# Altium project PCB_Project_sch_layout.PrjPcb
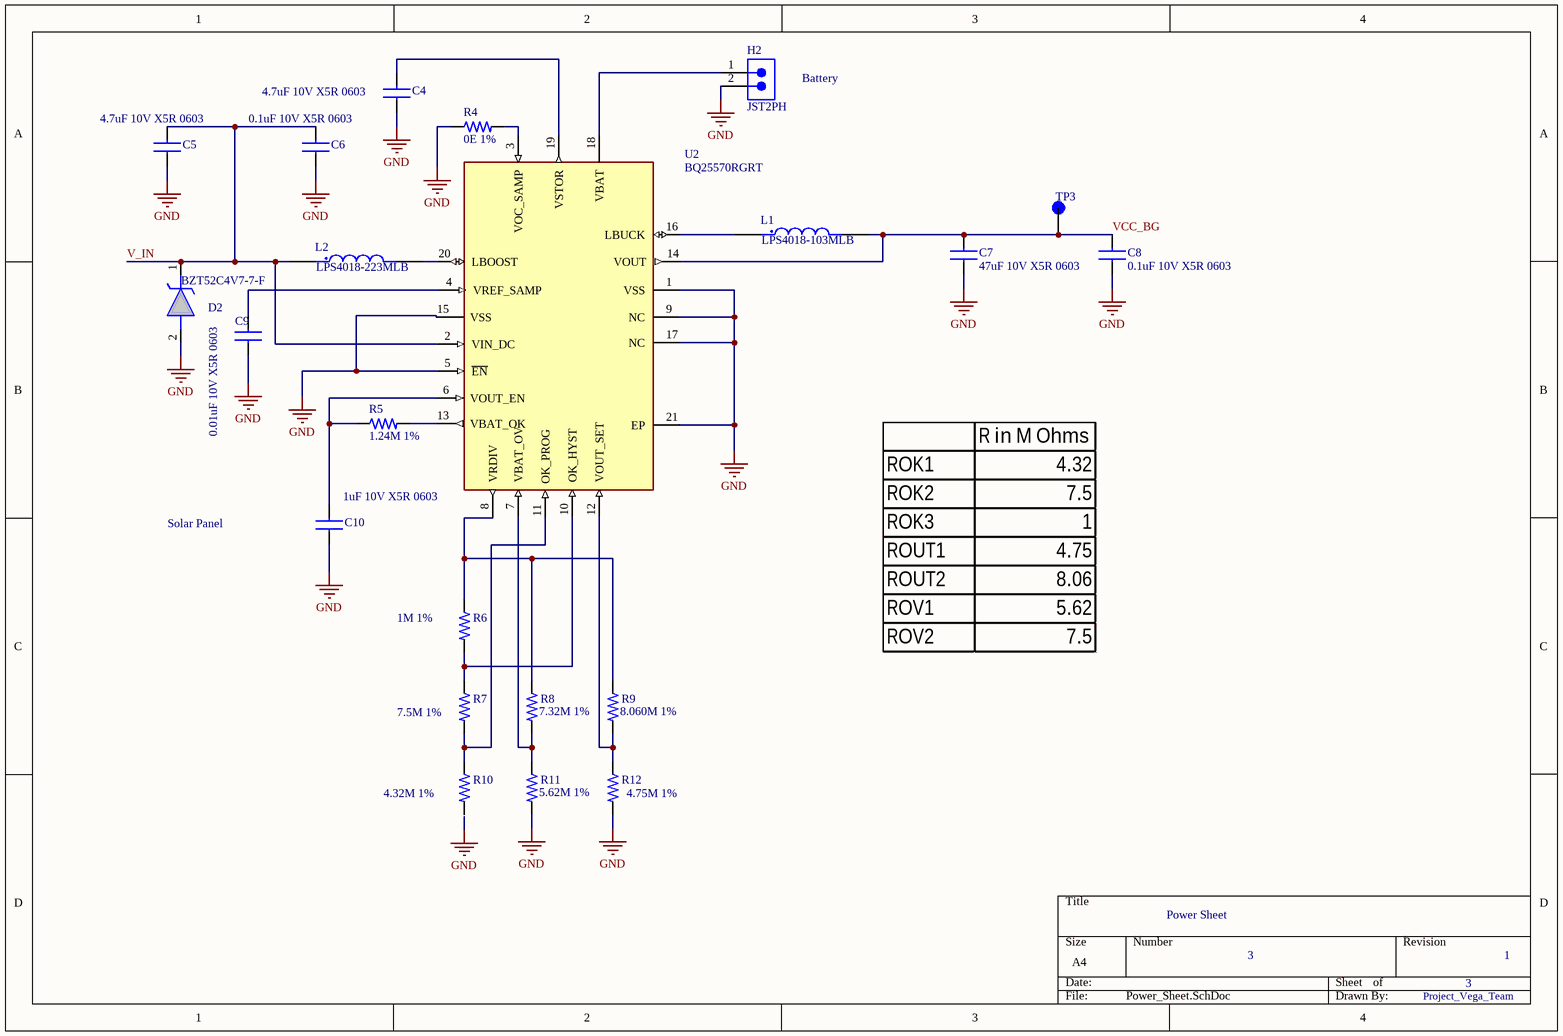
[diagram p0: Power_Sheet.SchDoc]
5 sheets, 120 parts. Net scope: flat (ports and power ports of the same name join across sheets).
Sheets:
  Power_Sheet.SchDoc
  Principal_Node.SchDoc
  Project_Node_Sensors.SchDoc
  Client_Node_1.SchDoc
  Client_Node_2.SchDoc

## Sheet Power_Sheet.SchDoc: Power Sheet
size A4; DrawnBy: Project_Vega_Team; Revision: 1; SheetNumber: 3; SheetTotal: 7

### Parts
C4  4.7uF 10V X5R 0603  [CAP_0603_1MM]
C5  4.7uF 10V X5R 0603  [CAP_0603_1MM]
C6  0.1uF 10V X5R 0603  [CAP_0603_1MM]
C7  47uF 10V X5R 0603  [CAP_0603_1MM]
C8  0.1uF 10V X5R 0603  [CAP_0603_1MM]
C9  0.01uF 10V X5R 0603  [CAP_0603_1MM]
C10  1uF 10V X5R 0603  [CAP_0603_1MM]
D2  BZT52C4V7-7-F  [SOD3716X145N]
H2  JST2PH  [JST_B2B-PH-K-S(LF)(SN)]
L1  LPS4018-103MLB  [IND_LPS4018-223MRC]
L2  LPS4018-223MLB  [IND_LPS4018-223MRC]
R4  0E 1%  [RES_0603_1608X06]
R5  1.24M 1%  [RES_0603_1608X06]
R6  1M 1%  [RES_0603_1608X06]
R7  7.5M 1%  [RES_0603_1608X06]
R8  7.32M 1%  [RES_0603_1608X06]
R9  8.060M 1%  [RES_0603_1608X06]
R10  4.32M 1%  [RES_0603_1608X06]
R11  5.62M 1%  [RES_0603_1608X06]
R12  4.75M 1%  [RES_0603_1608X06]
TP3  Test_point  [TP]  (value not drawn)
U2  BQ25570RGRT  [QFN50P350X350X100-21N]

### Nets
GND: C4.1 C5.1 C6.1 C7.1 C8.1 C9.1 C10.1 D2.2(A) H2.2 R4.1 R11.2 R12.2 U2.1(VSS) U2.5(~{EN}) U2.9(NC) U2.15(VSS) U2.17(NC) U2.21(EP)
V_IN: C5.2 C6.2 D2.1(K) L2.1 U2.2(VIN_DC)
VCC_BG: C7.2 C8.2 L1.2 TP3.TP U2.14(VOUT)
NetC4_2: C4.2 U2.19(VSTOR)
NetC9_2: C9.2 U2.4(VREF_SAMP)
NetC10_2: C10.2 R5.1 U2.6(VOUT_EN)
NetH2_1: H2.1 U2.18(VBAT)
NetL1_1: L1.1 U2.16(LBUCK)
NetL2_2: L2.2 U2.20(LBOOST)
NetR4_2: R4.2 U2.3(VOC_SAMP)
NetR5_2: R5.2 U2.13(VBAT_OK)
NetR6_1: R6.1 R8.1 R9.1 U2.8(VRDIV)
NetR6_2: R6.2 R7.1 U2.10(OK_HYST)
NetR7_2: R7.2 R10.1 U2.11(OK_PROG)
NetR8_2: R8.2 R11.1 U2.7(VBAT_OV)
NetR9_2: R9.2 R12.1 U2.12(VOUT_SET)

Not connected (* = marked no-connect by the designer): R10 2

### Notes on the sheet
- Battery
- Solar Panel

### Library data of the parts
C4-C10 = GRM188R61A226ME15D: CAP CER 22UF 10V X5R 0603; Manufacturer: Murata; Voltage Rating DC: 10 VDC; Tolerance: 20 %; Brand: Murata Electronics; Type: Voltage and Temperature Derating Recommended Product; Unit Weight: 0.000222 oz; Supplier 1: Digi-Key; Supplier Part Number 1: 490-10476-1-ND; Manufacturer Part Number: GRM188R61A226ME15D; Stock 1: 849458; Pricing 1: 1=0.33, 10=0.226, 50=0.1506, 100=0.1279, 500=0.0903, 1000=0.079 (USD); Product Category: Multilayer Ceramic Capacitors MLCC - SMD/SMT; RoHS: True; Capacitance: 22 uF; Dielectric: X5R; Case Code - in: 0603; Case Code - mm: 1608; Height: 0.8 mm; Maximum Operating Temperature: + 85 C; Minimum Operating Temperature: - 55 C; Product: General Type MLCCs; Series: GRM; Packaging: Reel; Length: 1.6 mm; Package / Case: 0603 (1608 metric); Factory Pack Quantity: 4000; Termination Style: SMD/SMT; Width: 0.8 mm; ComponentLink1URL: http://www.farnell.com/datasheets/2047978.pdf?src-supplier=Element14; ComponentLink1Description: http://www.farnell.com/datasheets/2047978.pdf?src-supplier=Element14
D2 = BZT52C4V7-7-F: Diodes Inc BZT52C4V7-7-F Zener Diode, 4.7V 7% 500 mW SMT 2-Pin SOD-123; Manufacturer_Name: Diodes Incorporated; Geometry.Height: 1.45mm; Manufacturer_Part_Number: BZT52C4V7-7-F; Mouser Part Number: 621-BZT52C4V7-F; Mouser Price/Stock: https://www.mouser.co.uk/ProductDetail/Diodes-Incorporated/BZT52C4V7-7-F?qs=J8U5V1LGimN8O12FVAOKUQ%3D%3D; Arrow Part Number: BZT52C4V7-7-F; Arrow Price/Stock: https://www.arrow.com/en/products/bzt52c4v7-7-f/diodes-incorporated?region=nac; Datasheet Link: https://www.diodes.com/assets/Datasheets/ds18004.pdf
H2 = JST2PH: Connector Header Through Hole 2 position 0.079" (2.00mm); Manufacturer: JST; Manufacturer Part Number: B2B-PH-K-S; Supplier: Digi-Key; Supplier Part Number: 455-1704-ND; RoHS: Yes; Category: Connectors; Stock: 1077617; Pricing: 1=0.19, 10=0.147, 100=0.1088, 500=0.09006, 1000=0.0788, 5000=0.06754, 10000=0.06567 (USD); ComponentLink1URL: https://datasheet.ciiva.com/6905/phseries-6905929.pdf?src-supplier=Digi-Key; ComponentLink1Description: https://datasheet.ciiva.com/6905/phseries-6905929.pdf?src-supplier=Digi-Key
L1 L2 = LPS4018-223MRC: 22 µH Shielded Drum Core Inductor 650 mA 360mOhm Max Nonstandard; MF: Coilcraft; SnapEDA_Link: https://www.snapeda.com/parts/LPS4018-223MRC/Coilcraft/view-part/?ref=snap; Package: None; Value: *; MP: LPS4018-223MRC; Check_prices: https://www.snapeda.com/parts/LPS4018-223MRC/Coilcraft/view-part/?ref=eda
R4-R12 = RC0603FR-07316KL: SMD Chip Resistor, 316 kOhm, ± 1%, 100 mW, 0603 [1608 Metric], Thick Film, General Purpose; Manufacturer: Yageo; Value: 316kR; Power Rating: 100mW; Voltage Rating: 50V; Temperature Coefficient: 100ppm/°C; Supplier: Digikey; Supplier Part Number: 311-316KHRCT-ND; Manufacturer Part Number: RC0603FR-07316KL; RoHS: Yes; Category: Chip SMD Resistors; Stock: 149463; Pricing: 1=0.1, 10=0.019, 50=0.0112, 100=0.0093, 500=0.00622, 1000=0.00532 (USD); Mounting Technology: Surface Mount; Case/Package: 0603; Case Code (Imperial): 0603; Case Code (Metric): 1608; Min Operating Temperature: -55°C; Max Operating Temperature: 155°C; Tolerance: 1%; Packaging: Tape and Reel; Termination: SMD/SMT; Number of Terminations: 2; Max Power Dissipation: 100mW; Voltage Rating (DC): 50V; Features: Moisture Resistant; Series: RC; Lead Free: Lead Free; RoHS Compliant: Yes; ComponentLink1URL: https://datasheet.ciiva.com/2454/pyu-r-int-thick-7-2454966.pdf?src-supplier=Digikey; ComponentLink1Description: https://datasheet.ciiva.com/2454/pyu-r-int-thick-7-2454966.pdf?src-supplier=Digikey; ComponentLink2URL: https://datasheet.ciiva.com/2454/pyu-r-int-thick-7-2454967.pdf?src-supplier=Digikey; ComponentLink2Description: https://datasheet.ciiva.com/2454/pyu-r-int-thick-7-2454967.pdf?src-supplier=Digikey; ComponentLink3URL: https://datasheet.ciiva.com/2454/pyu-r-int-thick-7-2454968.pdf?src-supplier=Digikey; ComponentLink3Description: https://datasheet.ciiva.com/2454/pyu-r-int-thick-7-2454968.pdf?src-supplier=Digikey
TP3 = Test_point: SMT Test Point- Mininature-1000 pc Reels; MP: 5019; MF: Keystone Electronics; Value: *; Availability: In Stock; Purchase-URL: https://pricing.snapeda.com/search/part/5019/?ref=eda; Package: None; Price: None
U2 = BQ25570RGRT: Ultra Low power Harvester power Management IC with boost charger, and Nanopower Buck Converter 20-VQFN -40 to 125; MF: Texas Instruments; Availability: Warning; SnapEDA_Link: https://www.snapeda.com/parts/BQ25570RGRT/Texas%20Instruments/view-part/49255/?ref=snap; MP: BQ25570RGRT; Value: *; Price: None; Package: VQFN-20 Texas Instruments; Purchase-URL: https://pricing.snapeda.com/search/part/BQ25570RGRT/?ref=eda; Check_prices: https://www.snapeda.com/parts/BQ25570RGRT/Texas%20Instruments/view-part/49255/?ref=eda; Supplier 1: Digikey; Supplier Part Number 1: 296-37014-1-ND

## Sheet Principal_Node.SchDoc: Principal_Node
size A; DrawnBy: Project_Vega_Team; Revision: 1; SheetNumber: 4; SheetTotal: 7
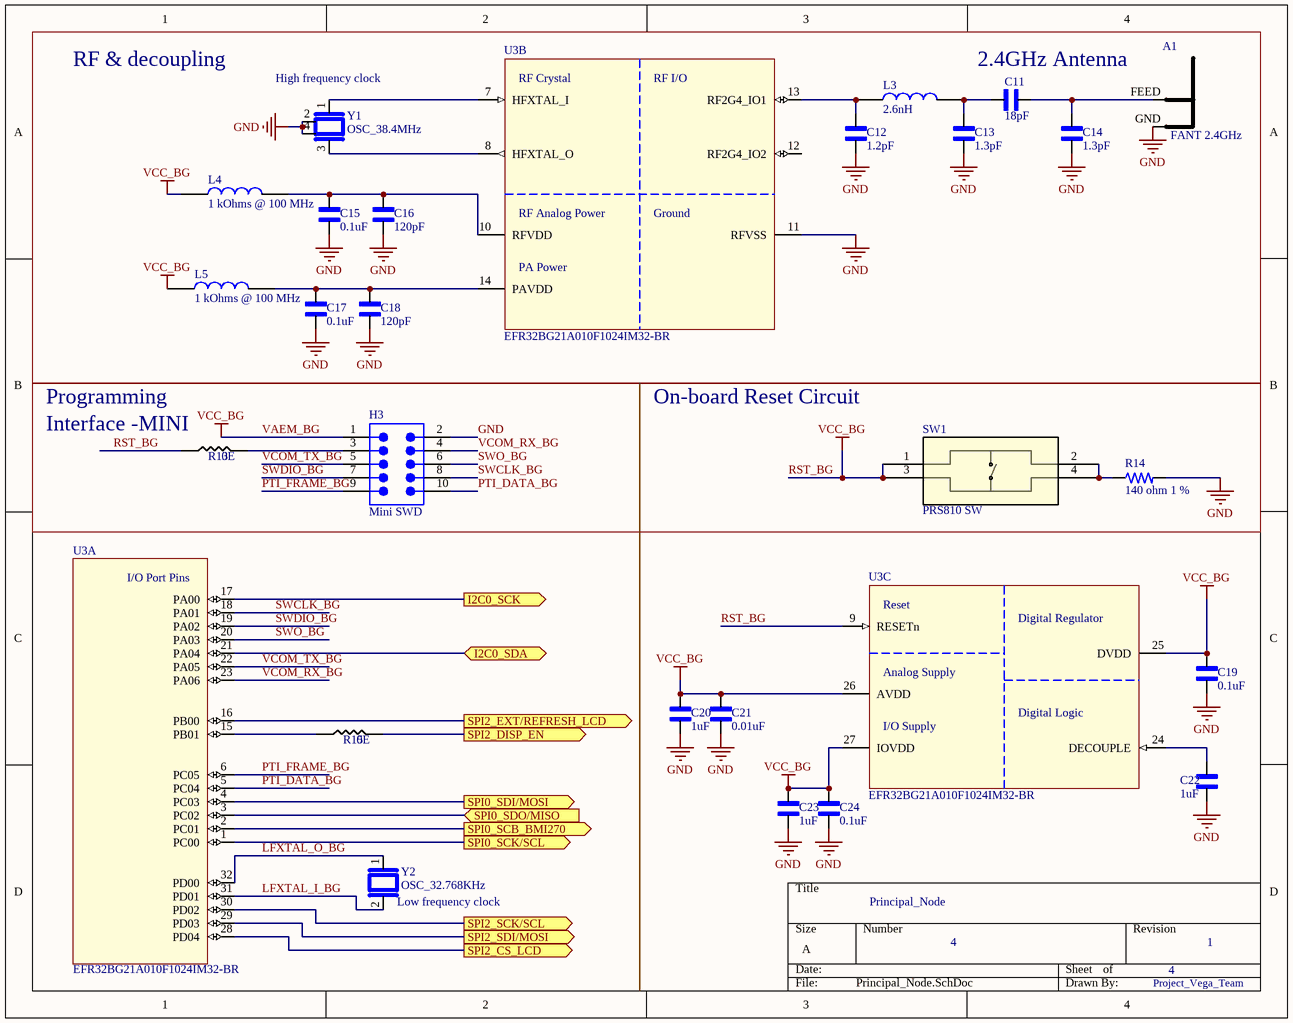
[diagram p1: Principal_Node.SchDoc]

### Parts
A1  FANT 2.4GHz  [FANT_2P4]
C11  18pF  [CAPC1608X90]
C12  1.2pF  [CAPC1608X90]
C13  1.3pF  [CAPC1608X90]
C14  1.3pF  [CAPC1608X90]
C15  0.1uF  [CAPC1608X90]
C16  120pF  [CAPC1608X90]
C17  0.1uF  [CAPC1608X90]
C18  120pF  [CAPC1608X90]
C19  0.1uF  [CAPC1608X90]
C20  1uF  [CAPC1608X90]
C21  0.01uF  [CAPC1608X90]
C22  1uF  [CAPC1608X90]
C23  1uF  [CAPC1608X90]
C24  0.1uF  [CAPC1608X90]
H3  Mini SWD  [FTSH-105-01-XXX-DV-K]
L3  2.6nH  [INDC1608X95N]
L4  1 kOhms @ 100 MHz  [INDC1608X95N]
L5  1 kOhms @ 100 MHz  [INDC1608X95N]
R13  value 0E  [1206_Passive_Resitor]  (hidden comment: 10k)
R14  140 ohm 1 %  [RES_0603_1608X06]
R15  value 0E  [1206_Passive_Resitor]  (hidden comment: 10k)
SW1  PRS810 SW  [PTS810_CNK]
U3  EFR32BG21A010F1024IM32-BR  [QFN32-EFR32xG2xIM32-BR]  (parts A,B,C of 3)  (no BOM)
Y1  OSC_38.4MHz  [OSC_38.4MHz]
Y2  OSC_32.768KHz  [OSC_32.768KHz]

### Ports
I2C0_SCK (out, see Project_Node_Sensors[2A], Project_Node_Sensors[3C]), I2C0_SDA (bidir, see Project_Node_Sensors[2A], Project_Node_Sensors[2C]), SPI0_SCB_BMI270 (out, see Project_Node_Sensors[1A]), SPI0_SCK/SCL (out, see Project_Node_Sensors[1A]), SPI0_SDI/MOSI (out, see Project_Node_Sensors[1A]), SPI0_SDO/MISO (in, see Project_Node_Sensors[1A]), SPI2_CS_LCD (out, see Project_Node_Sensors[1C]), SPI2_DISP_EN (out, see Project_Node_Sensors[1C]), SPI2_EXT/REFRESH_LCD (out, see Project_Node_Sensors[1C]), SPI2_SCK/SCL (out, see Project_Node_Sensors[1C]), SPI2_SDI/MOSI (out, see Project_Node_Sensors[1C])

### Nets
GND: A1.GND C12.2 C13.2 C14.2 C15.2 C16.2 C17.2 C18.2 C19.2 C20.2 C21.2 C22.2 C23.2 C24.2 H3.2 R14.2 U3.11(RFVSS) Y1.2 Y1.4
RST_BG: C19.1 C20.1 C21.1 C23.1 C24.1 H3.1 L4.1 L5.1 R13.1 SW1.1 SW1.3 U3.9(RESETn) U3.25(DVDD) U3.26(AVDD) U3.27(IOVDD)  [also labelled VAEM_BG, VCC_BG]
I2C0_SCK: U3.17(PA00) ; port I2C0_SCK
I2C0_SDA: U3.21(PA04) ; port I2C0_SDA
LFXTAL_I_BG: U3.31(PD01) Y2.2
LFXTAL_O_BG: U3.32(PD00) Y2.1
PTI_DATA_BG: H3.10 U3.5(PC04)
PTI_FRAME_BG: H3.9 U3.6(PC05)
SWCLK_BG: H3.8 U3.18(PA01)
SWDIO_BG: H3.7 U3.19(PA02)
SWO_BG: H3.6 U3.20(PA03)
VCOM_RX_BG: H3.4 U3.23(PA06)
VCOM_TX_BG: H3.5 U3.22(PA05)
NetA1_FEED: A1.FEED C11.2 C14.1
NetC11_1: C11.1 C13.1 L3.2
NetC12_1: C12.1 L3.1 U3.13(RF2G4_IO1)
NetC15_1: C15.1 C16.1 L4.2 U3.10(RFVDD)
NetC17_1: C17.1 C18.1 L5.2 U3.14(PAVDD)
NetC22_1: C22.1 U3.24(DECOUPLE)
NetC30_2: R15.2 ; port SPI2_DISP_EN
NetH3_3: H3.3 R13.2
NetP1_1: U3.30(PD02) ; port SPI2_SCK/SCL
NetP1_2: U3.29(PD03) ; port SPI2_SDI/MOSI
NetP1_3: U3.28(PD04) ; port SPI2_CS_LCD
NetP1_4: U3.16(PB00) ; port SPI2_EXT/REFRESH_LCD
NetR14_1: R14.1 SW1.2 SW1.4
NetR15_1: R15.1 U3.15(PB01)
NetTP4_TP: U3.2(PC01) ; port SPI0_SCB_BMI270
NetTP5_TP: U3.1(PC00) ; port SPI0_SCK/SCL
NetTP6_TP: U3.4(PC03) ; port SPI0_SDI/MOSI
NetTP7_TP: U3.3(PC02) ; port SPI0_SDO/MISO
NetU3_7: U3.7(HFXTAL_I) Y1.1
NetU3_8: U3.8(HFXTAL_O) Y1.3

Not connected (* = marked no-connect by the designer): U3 12(RF2G4_IO2)

### Notes on the sheet
- RF & decoupling
- (near Y1) High frequency clock
- (near C11) 2.4GHz Antenna
- (near R13) Programming
- (near R13) Interface -MINI
- On-board Reset Circuit
- (near Y2) Low frequency clock
- (in symbol EFR32BG21A010F1024IM32-BR, part A) I/O Port Pins
- (in symbol EFR32BG21A010F1024IM32-BR, part B) RF Crystal; RF I/O; RF Analog Power; Ground; PA Power
- (in symbol EFR32BG21A010F1024IM32-BR, part C) Reset; Digital Regulator; Analog Supply; Digital Logic; I/O Supply

### Library data of the parts
A1 = FANT_2P4: Inverted F antenna
C11-C24 = CC0603KRX7R9BB104: 0.1 ÂµF Â±10% 50V Ceramic Capacitor X7R 0603 (1608 Metric); MF: Yageo; SnapEDA_Link: https://www.snapeda.com/parts/CC0603KRX7R9BB104/Yageo/view-part/?ref=snap; Package: 0603 Yageo; Value: *; MP: CC0603KRX7R9BB104; Check_prices: https://www.snapeda.com/parts/CC0603KRX7R9BB104/Yageo/view-part/?ref=eda
H3 = Debug Connector Mini SWD - 0.05": Mini SWD 0.05" Pitch Connector - 10 Pin SMT Box Header; Manufacturer: Adafruit Industries; Manufacturer Part Number: 4048; Supplier 1: Digi-Key; RoHS: No; Category: Connectors; Stock 1: 201; Pricing 1: 1=1.95000 (USD); ComponentLink1URL: https://media.digikey.com/pdf/Data%20Sheets/Adafruit%20PDFs/4048_Web.pdf?src-supplier=Digi-Key; ComponentLink1Description: https://media.digikey.com/pdf/Data%20Sheets/Adafruit%20PDFs/4048_Web.pdf?src-supplier=Digi-Key
L3-L5 = LQM18DN100M70L: Inductor with Inductance 10uH Tol.+/-20% Package 0603 (1608); MF: Murata Electronics; MP: LQM18DN100M70L; Price: None; SnapEDA_Link: https://www.snapeda.com/parts/LQM18DN100M70L/Murata/view-part/4834755/?ref=snap; Package: 0603 Murata; Availability: Unavailable; Value: *
R13 R15 = R_10KOhm_1206: 10 kOhms ±5% 0.25W, 1/4W Chip Resistor 1206 (3216 Metric) Automotive AEC-Q200 Thick Film; MFR Part #: RMCF1206FT10K0; Digikey Link: https://www.digikey.com/en/products/detail/stackpole-electronics-inc/RMCF1206FT10K0/1759669; LCSC Part#: C17902; Type: Basic
R14 = RC0603FR-07140RL: SMD Chip Resistor, 140 Ohm, ± 1%, 100 mW, 0603 [1608 Metric], Thick Film, General Purpose; Manufacturer: Yageo; Value: 140R; Power Rating: 100mW; Voltage Rating: 50V; Temperature Coefficient: 100ppm/°C; Supplier: Digikey; Supplier Part Number: 311-140HRCT-ND; Manufacturer Part Number: RC0603FR-07140RL; RoHS: Yes; Category: Chip SMD Resistors; Stock: 238807; Pricing: 1=0.1, 10=0.019, 50=0.0112, 100=0.0093, 500=0.00622, 1000=0.00532, 5000=0.00382, 10000=0.00335, 25000=0.00287, 35000=0.00278, 50000=0.00257, 125000=0.00232 (USD); Mounting Technology: Surface Mount; Case/Package: 0603; Case Code (Imperial): 0603; Case Code (Metric): 1608; Min Operating Temperature: -55°C; Max Operating Temperature: 155°C; Tolerance: 1%; Packaging: Tape and Reel; Termination: SMD/SMT; Voltage Rating (DC): 50V; Features: Moisture Resistant; Series: RC; Max Power Dissipation: 100mW; Number of Terminations: 2; Construction: Rectangular; Technology: THICK FILM; Length: 1.6mm; Height: 0.45mm; Depth: 0.8mm; Lead Free: Lead Free; RoHS Compliant: Yes; Military Standard: Not; ComponentLink1URL: https://datasheet.ciiva.com/11808/0900766b80c66297-11808828.pdf?src-supplier=Rs; ComponentLink1Description: https://datasheet.ciiva.com/11808/0900766b80c66297-11808828.pdf?src-supplier=Rs; ComponentLink2URL: https://datasheet.ciiva.com/15189/getdatasheetpartid-329205-15189606.pdf?src-supplier=Verical; ComponentLink2Description: https://datasheet.ciiva.com/15189/getdatasheetpartid-329205-15189606.pdf?src-supplier=Verical
SW1 = PTS810SJM250SMTRLFS: Switch Tactile N.O. SPST Button J-Bend 0.05A 16V 150000Cycles 1.569N SMD T/R; Manufacturer: ITT C&K; Actuator Color: Grey; Operating Force: 160gf; Current Rating: 50mA; Illumination Type: Non-Illuminated; Switch Travel: 0.15mm; Switch Function: Off-Mom; Number of Positions: 2; Actuator Type: Standard; Contact Resistance: 500mR; Supplier: Digikey; Supplier Part Number: CKN10502CT-ND; Manufacturer Part Number: PTS810SJM250SMTRLFS; RoHS: Yes; Stock: 130228; Pricing: 1=0.49, 10=0.474, 25=0.4568, 100=0.3954, 250=0.36028, 500=0.3339, 1000=0.29876, 2900=0.28294, 5800=0.26185, 14500=0.24428 (USD); Mounting Technology: Surface Mount; Case/Package: SMD/SMT; Pins: 4; Mechanical Life: 150000Cycles; Color: Black; Contact Plating: Silver; Min Operating Temperature: -40°C; Max Operating Temperature: 85°C; Throw Configuration: SPST; Packaging: Tape and Reel; Voltage Rating (DC): 16V; Package Quantity: 2900; Series: PTS810; Termination: J-Bend; Max Current Rating: 50mA; Orientation: Straight; Contact Current Rating: 50mA; Length: 3.2mm; Depth: 4.6mm; RoHS Compliant: Yes; Lead Free: Lead Free; ComponentLink1URL: https://datasheet.ciiva.com/24082/pts810-4mar13-248115-24082262.pdf?src-supplier=Mouser; ComponentLink1Description: https://datasheet.ciiva.com/24082/pts810-4mar13-248115-24082262.pdf?src-supplier=Mouser; ComponentLink2URL: https://datasheet.ciiva.com/18514/pts810-4mar13-18514058.pdf?src-supplier=Digikey; ComponentLink2Description: https://datasheet.ciiva.com/18514/pts810-4mar13-18514058.pdf?src-supplier=Digikey; ComponentLink3URL: https://datasheet.ciiva.com/18514/pts810-4mar13-18514059.pdf?src-supplier=Digikey; ComponentLink3Description: https://datasheet.ciiva.com/18514/pts810-4mar13-18514059.pdf?src-supplier=Digikey; ComponentLink4URL: https://datasheet.ciiva.com/18514/pts810-4mar13-18514060.pdf?src-supplier=Digikey; ComponentLink4Description: https://datasheet.ciiva.com/18514/pts810-4mar13-18514060.pdf?src-supplier=Digikey
U3 = EFR32BG21A010F1024IM32-BR: Blue Gecko, QFN32, 2.4G, 10dB, Bluetooth 5.1, 1024kB, 96kB(RAM), 20 GPIO; Manufacturer: Silicon Labs; Supplier: Digikey; Supplier Part Number: 336-5869-1-ND; Manufacturer Part Number: EFR32BG21A010F1024IM32-BR; RoHS: No; Category: RF Receivers, Transceivers; Stock: 38892; Pricing: 1=4.27, 10=3.816, 25=3.4348, 100=3.1293, 250=2.82404, 500=2.6875 (USD); ComponentLink1URL: https://www.silabs.com/documents/login/data-sheets/efr32bg21-datasheet.pdf?src-supplier=Digikey; ComponentLink1Description: https://www.silabs.com/documents/login/data-sheets/efr32bg21-datasheet.pdf?src-supplier=Digikey; ComponentLink2URL: https://datasheet.octopart.com/EFR32BG21A010F1024IM32-BR-Silicon-Labs-datasheet-142046433.pdf?src-supplier=Arrow.cn; ComponentLink2Description: https://datasheet.octopart.com/EFR32BG21A010F1024IM32-BR-Silicon-Labs-datasheet-142046433.pdf?src-supplier=Arrow.cn
Y1 = OSC_38.4MHz: 38.4 MHz ±10ppm Crystal 10pF 40 Ohms 4-SMD, No Lead; MF: {'manufacturer': u'Murata Electronics'}; MP: XRCGB38M400F2P00R0; Package: None; Price: None; Value: *; Availability: Unavailable; Supplier 1: Digikey; Supplier Part Number 1: 4606-TZ3398BCT-ND
Y2 = OSC_32.768KHz: Tuning Fork Crystal 32.768kHz in 1.2 x 2.0mm package; MF: Micro Crystal; MP: CM8V-T1A-32.768KHZ-7PF-20PPM-TA-QC; Package: SMD-2 Micro Crystal; Price: None; Value: *; SnapEDA_Link: https://www.snapeda.com/parts/CM8V-T1A-32.768KHZ-7PF-20PPM-TA-QC/Micro+Crystal/view-part/?ref=snap; Availability: Not in stock; Check_prices: https://www.snapeda.com/parts/CM8V-T1A-32.768KHZ-7PF-20PPM-TA-QC/Micro+Crystal/view-part/?ref=eda; Supplier 1: Digikey; Supplier Part Number 1: 2195-CM8V-T1A-32.768KHZ-7PF-20PPM-TA-QCCT-ND

## Sheet Project_Node_Sensors.SchDoc: Principal Node_Sensor Schematic
size A; Date: 10/08/2024; Author: Prudhvi Kondapalli; CompanyName: CU Boulder; DrawnBy: Project_Vega_Team; Engineer: Prudhvi Kondapalli; DocumentNumber: 1; Revision: 1; SheetNumber: 5; SheetTotal: 7
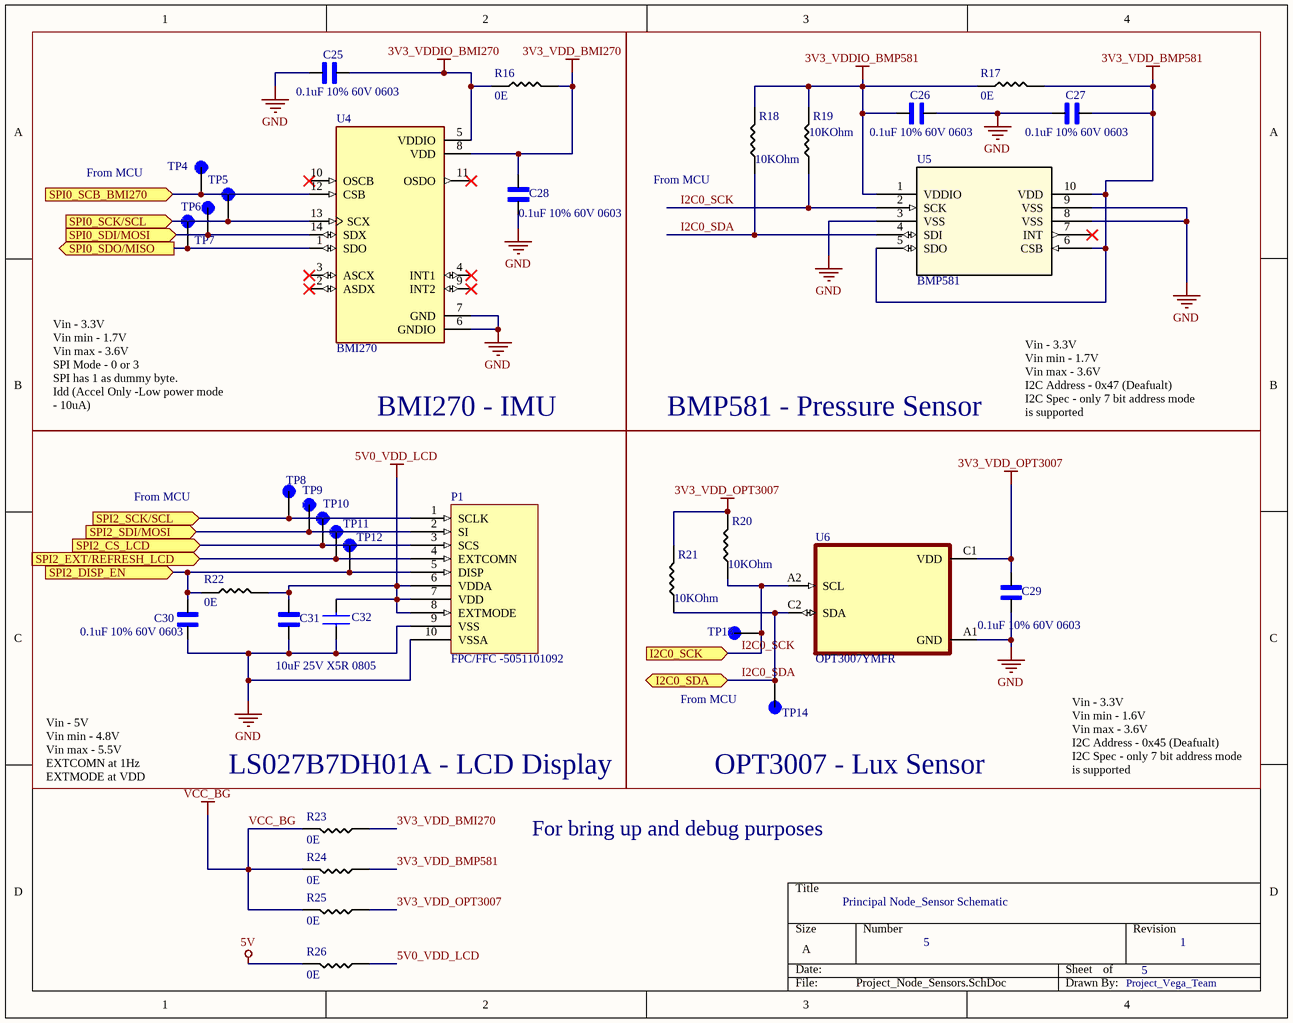
[diagram p2: Project_Node_Sensors.SchDoc]

### Parts
C25  0.1uF 10% 60V 0603  [CAPC1608X90]
C26  0.1uF 10% 60V 0603  [CAPC1608X90]
C27  0.1uF 10% 60V 0603  [CAPC1608X90]
C28  0.1uF 10% 60V 0603  [CAPC1608X90]
C29  0.1uF 10% 60V 0603  [CAPC1608X90]
C30  0.1uF 10% 60V 0603  [CAPC1608X90]
C31  0.1uF 10% 60V 0603  [CAPC1608X90]  (value not drawn)
C32  10uF 25V X5R 0805  [CAP_0805_2mmX1.25mm]
P1  FPC/FFC -5051101092  [CON_5051101092_MOL]
R16  value 0E  [1206_Passive_Resitor]  (hidden comment: 10k)
R17  value 0E  [1206_Passive_Resitor]  (hidden comment: 10k)
R18  value 10KOhm  [1206_Passive_Resitor]  (hidden comment: 10k)
R19  value 10KOhm  [1206_Passive_Resitor]  (hidden comment: 10k)
R20  value 10KOhm  [1206_Passive_Resitor]  (hidden comment: 10k)
R21  value 10KOhm  [1206_Passive_Resitor]  (hidden comment: 10k)
R22  value 0E  [1206_Passive_Resitor]  (hidden comment: 10k)
R23  value 0E  [1206_Passive_Resitor]  (hidden comment: 10k)
R24  value 0E  [1206_Passive_Resitor]  (hidden comment: 10k)
R25  value 0E  [1206_Passive_Resitor]  (hidden comment: 10k)
R26  value 0E  [1206_Passive_Resitor]  (hidden comment: 10k)
TP4  Test_point  [TP]  (value not drawn)
TP5  Test_point  [TP]  (value not drawn)
TP6  Test_point  [TP]  (value not drawn)
TP7  Test_point  [TP]  (value not drawn)
TP8  Test_point  [TP]  (value not drawn)
TP9  Test_point  [TP]  (value not drawn)
TP10  Test_point  [TP]  (value not drawn)
TP11  Test_point  [TP]  (value not drawn)
TP12  Test_point  [TP]  (value not drawn)
TP13  Test_point  [TP]  (value not drawn)
TP14  Test_point  [TP]  (value not drawn)
U4  BMI270  [XDCR_BMI270]
U5  BMP581  [QFN10_BMP581_BOS-M]
U6  OPT3007YMFR  [BGA6N60X35P2X3_85X94X22N]

### Blocks framed on the sheet
BMI270 - IMU: C25 C28 R16 TP4-TP7 U4
BMP581 - Pressure Sensor: C26 C27 R17-R19 U5

### Ports
I2C0_SCK (in, see Principal_Node[2C]), I2C0_SDA (bidir, see Principal_Node[2C]), SPI0_SCB_BMI270 (in, see Principal_Node[2D]), SPI0_SCK/SCL (in, see Principal_Node[2D]), SPI0_SDI/MOSI (in, see Principal_Node[2D]), SPI0_SDO/MISO (out, see Principal_Node[2D]), SPI2_CS_LCD (in, see Principal_Node[2D]), SPI2_DISP_EN (in, see Principal_Node[2C]), SPI2_EXT/REFRESH_LCD (in, see Principal_Node[2C]), SPI2_SCK/SCL (in, see Principal_Node[2D]), SPI2_SDI/MOSI (in, see Principal_Node[2D])

### Nets
3V3_VDD_BMI270: C28.1 R16.2 R23.1 U4.8(VDD)
3V3_VDD_BMP581: C27.2 R17.2 R24.1 U5.5(SDO) U5.6(CSB) U5.10(VDD)
3V3_VDD_OPT3007: C29.2 R20.2 R21.2 R25.1 U6.C1(VDD)
3V3_VDDIO_BMI270: C25.2 R16.1 U4.5(VDDIO)
3V3_VDDIO_BMP581: C26.1 R17.1 R18.2 R19.2 U5.1(VDDIO)
5V: R26.2
5V0_VDD_LCD: C31.2 C32.1 P1.6(VDDA) P1.7(VDD) P1.8(EXTMODE) R22.2 R26.1
GND: C25.1 C26.2 C27.1 C28.2 C29.1 C30.1 C31.1 C32.2 P1.9(VSS) P1.10(VSSA) U4.6(GNDIO) U4.7(GND) U5.3(VSS) U5.8(VSS) U5.9(VSS) U6.A1(GND)
VCC_BG: R23.2 R24.2 R25.2  [project net RST_BG]
I2C0_SCK: R19.1 R20.1 TP13.TP U5.2(SCK) U6.A2(SCL) ; port I2C0_SCK
I2C0_SDA: R18.1 R21.1 TP14.TP U5.4(SDI) U6.C2(SDA) ; port I2C0_SDA
NetC30_2: C30.2 P1.5(DISP) R22.1 TP12.TP ; port SPI2_DISP_EN
NetP1_1: P1.1(SCLK) TP8.TP ; port SPI2_SCK/SCL
NetP1_2: P1.2(SI) TP9.TP ; port SPI2_SDI/MOSI
NetP1_3: P1.3(SCS) TP10.TP ; port SPI2_CS_LCD
NetP1_4: P1.4(EXTCOMN) TP11.TP ; port SPI2_EXT/REFRESH_LCD
NetTP4_TP: TP4.TP U4.12(CSB) ; port SPI0_SCB_BMI270
NetTP5_TP: TP5.TP U4.13(SCX) ; port SPI0_SCK/SCL
NetTP6_TP: TP6.TP U4.14(SDX) ; port SPI0_SDI/MOSI
NetTP7_TP: TP7.TP U4.1(SDO) ; port SPI0_SDO/MISO

Not connected (* = marked no-connect by the designer): U4 2(ASDX)* 3(ASCX)* 4(INT1)* 9(INT2)* 10(OSCB)* 11(OSDO)*; U5 7(INT)*

### Notes on the sheet
- From MCU
- Vin - 3.3V
  Vin min - 1.7V
  Vin max - 3.6V
  SPI Mode - 0 or 3
  SPI has 1 as dummy byte.
  Idd (Accel Only -Low power mode - 10uA)
- Vin - 3.3V
  Vin min - 1.7V
  Vin max - 3.6V
  I2C Address - 0x47 (Deafualt)
  I2C Spec - only 7 bit address mode is supported
- Vin - 5V
  Vin min - 4.8V
  Vin max - 5.5V
  EXTCOMN at 1Hz
  EXTMODE at VDD
- (near R23) LS027B7DH01A - LCD Display
- (near TP14) OPT3007 - Lux Sensor
- Vin - 3.3V
  Vin min - 1.6V
  Vin max - 3.6V
  I2C Address - 0x45 (Deafualt)
  I2C Spec - only 7 bit address mode is supported
- For bring up and debug purposes

### Library data of the parts
C25-C31 = CC0603KRX7R9BB104: as C11 on sheet Principal_Node; SnapEDA_Link: https://www.snapeda.com/parts/CC0603KRX7R9BB104/Yageo/view-part/?ref=snap; Package: 0603 Yageo; Value: *; MP: CC0603KRX7R9BB104; Check_prices: https://www.snapeda.com/parts/CC0603KRX7R9BB104/Yageo/view-part/?ref=eda
C32 = GRM21BR61E106KA73K: Multilayer Ceramic Capacitor, 10 uF, 25 V, +/- 10%, X5R, 0805 [2012 Metric]; Manufacturer: Murata; Supplier: Digikey; Supplier Part Number: 490-16824-1-ND; Manufacturer Part Number: GRM21BR61E106KA73K; RoHS: Yes; Category: Ceramic Capacitors; Stock: 274241; Pricing: 1=0.21, 10=0.133, 50=0.0838, 100=0.0671, 500=0.04848, 1000=0.04288, 2500=0.04102, 5000=0.03729, 10000=0.03542, 20000=0.03356, 30000=0.03169, 50000=0.02983, 100000=0.02517, 250000=0.0233 (USD); Mounting Technology: Surface Mount; Case/Package: 0805; Weight: 0.000335oz; Case Code (Imperial): 0805; Case Code (Metric): 2012; Material: Ceramic; Min Operating Temperature: -55°C; Max Operating Temperature: 85°C; Packaging: Tape and Reel; Value: 10uF; Voltage Rating: 25V; Tolerance: 10%; Package Quantity: 10000; Dielectric: X5R; Voltage Rating (DC): 25V; Series: GRM; Length: 0.079inch; Width: 0.049inch; Height: 1.4mm; Thickness: 0.055inch; RoHS Compliant: Yes; ComponentLink1URL: http://www.mouser.com/ds/2/281/c02e-2905.pdf?src-supplier=Mouser; ComponentLink1Description: http://www.mouser.com/ds/2/281/c02e-2905.pdf?src-supplier=Mouser; ComponentLink2URL: http://search.murata.co.jp/Ceramy/image/img/A01X/G101/ENG/GRM21BR61E106KA73-01.pdf?src-supplier=Digikey; ComponentLink2Description: http://search.murata.co.jp/Ceramy/image/img/A01X/G101/ENG/GRM21BR61E106KA73-01.pdf?src-supplier=Digikey; ComponentLink3URL: https://search.murata.co.jp/Ceramy/image/img/A01X/G101/ENG/GRM21BR61E106KA73-01.pdf?src-supplier=Digikey; ComponentLink3Description: https://search.murata.co.jp/Ceramy/image/img/A01X/G101/ENG/GRM21BR61E106KA73-01.pdf?src-supplier=Digikey; ComponentLink4URL: https://datasheet.octopart.com/GRM21BR61E106KA73K-Murata-datasheet-149523495.pdf?src-supplier=Newark; ComponentLink4Description: https://datasheet.octopart.com/GRM21BR61E106KA73K-Murata-datasheet-149523495.pdf?src-supplier=Newark; ComponentLink5URL: https://datasheet.octopart.com/GRM21BR61E106KA73K-Murata-datasheet-99353849.pdf?src-supplier=Future+Electronics; ComponentLink5Description: https://datasheet.octopart.com/GRM21BR61E106KA73K-Murata-datasheet-99353849.pdf?src-supplier=Future+Electronics; ComponentLink6URL: https://datasheet.octopart.com/GRM21BR61E106KA73K-Murata-datasheet-165579666.pdf?src-supplier=TME; ComponentLink6Description: https://datasheet.octopart.com/GRM21BR61E106KA73K-Murata-datasheet-165579666.pdf?src-supplier=TME
P1 = 5051101092: 10 Position FFC, FPC Connector Contacts, Bottom 0.020" (0.50mm) Surface Mount, Right Angle
R16-R26 = R_10KOhm_1206: as R13 on sheet Principal_Node; Digikey Link: https://www.digikey.com/en/products/detail/stackpole-electronics-inc/RMCF1206FT10K0/1759669; LCSC Part#: C17902; Type: Basic
TP4-TP14 = Test_point: as TP3 on sheet Power_Sheet; Value: *; Availability: In Stock; Purchase-URL: https://pricing.snapeda.com/search/part/5019/?ref=eda; Package: None; Price: None
U4 = BMI270: Accelerometer, Gyroscope, 6 Axis Sensor IÂ²C, SPI Output; MF: Bosch Sensortec; Digi-Key_Part_Number: 828-1091-2-ND; Check_prices: https://www.snapeda.com/parts/BMI270/Bosch+Sensortec/view-part/?ref=eda; MP: BMI270; Package: LGA-14 Bosch Sensortec; SnapEDA_Link: https://www.snapeda.com/parts/BMI270/Bosch+Sensortec/view-part/?ref=snap; Value: *; Purchase-URL: https://pricing.snapeda.com/search/part/BMI270/?ref=eda
U5 = BMP581: No Description Available; Mfr_Name: Bosch Sensortec; RefDes: RefDes; Type: Type
U6 = OPT3007YMFR: Ultra-thin ambient light sensor (ALS) with fixed I2C address 6-PICOSTAR -40 to 85; MF: Texas Instruments; Value: *; MP: OPT3007YMFR; Package: PICOSTAR-6 Texas Instruments; Check_prices: https://www.snapeda.com/parts/OPT3007YMFR/Texas+Instruments/view-part/?ref=eda; Price: None; Purchase-URL: https://pricing.snapeda.com/search/part/OPT3007YMFR/?ref=eda; SnapEDA_Link: https://www.snapeda.com/parts/OPT3007YMFR/Texas+Instruments/view-part/?ref=snap; Availability: In Stock

## Sheet Client_Node_1.SchDoc: Client_Node_1
size A4; DrawnBy: Project_Vega_Team; Revision: 1; SheetNumber: 7; SheetTotal: 7
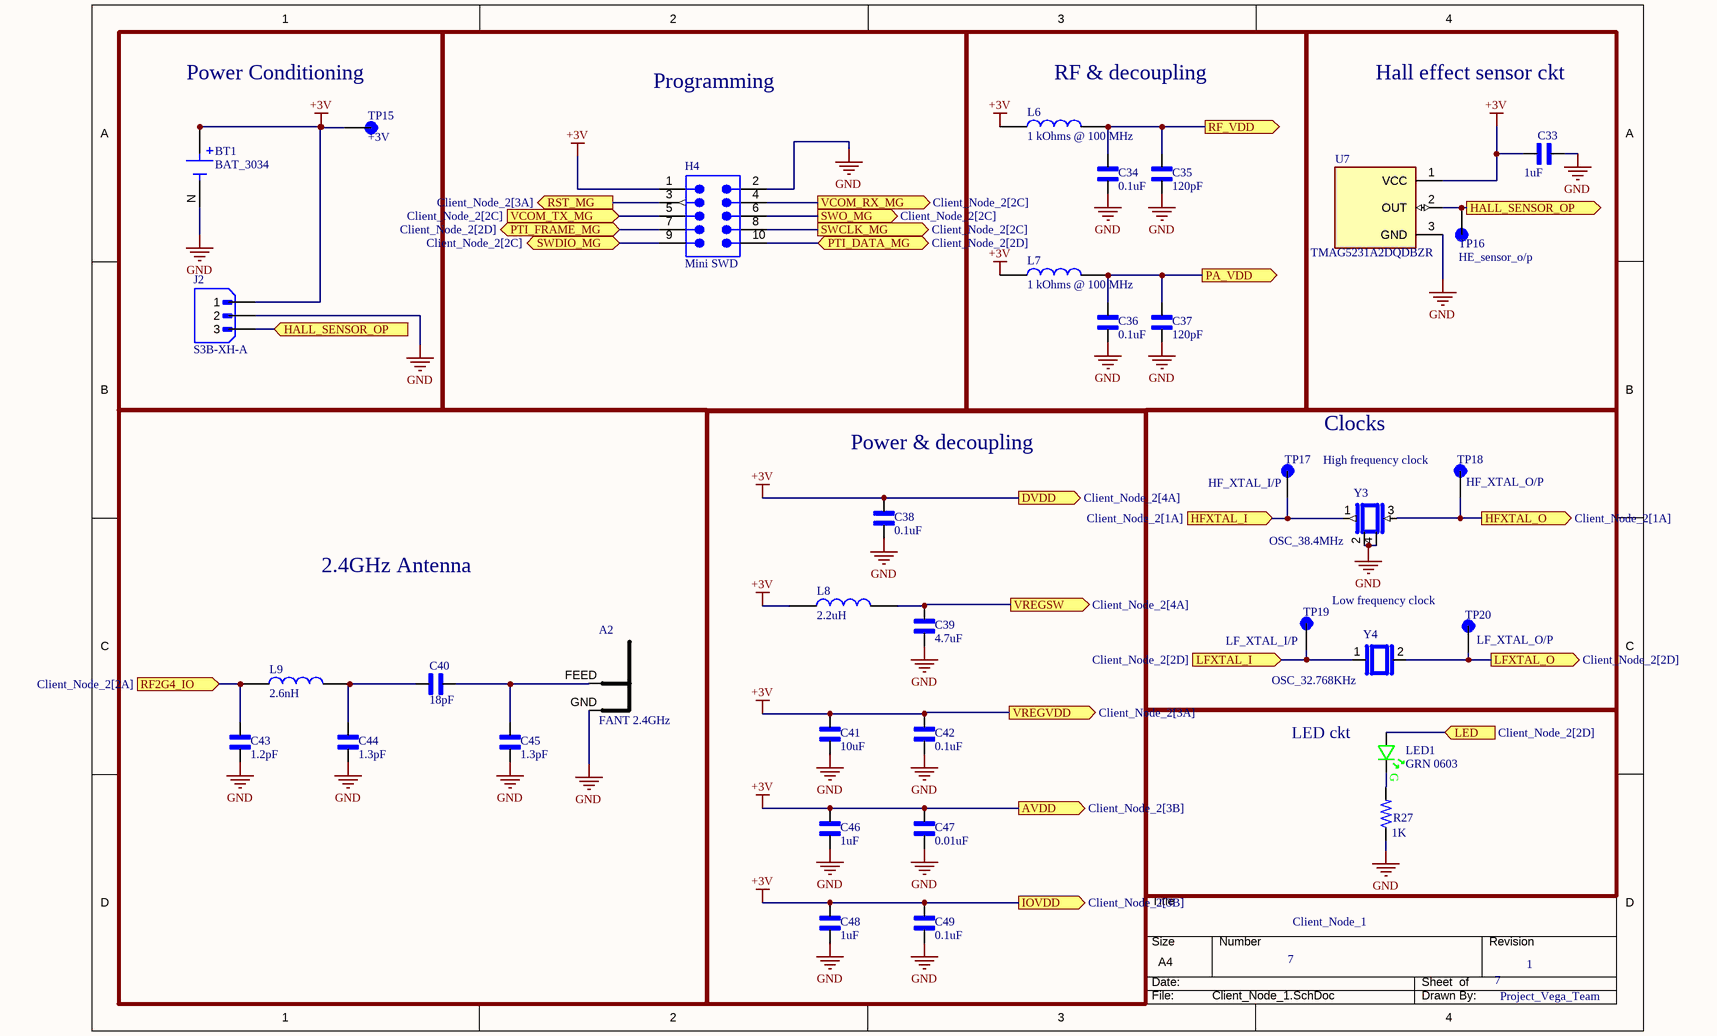
[diagram p3: Client_Node_1.SchDoc]

### Parts
A2  FANT 2.4GHz  [FANT_2P4]
BT1  BAT_3034  [BAT_3034]
C33  1uF  [CAPC1608X90]
C34  0.1uF  [CAPC1608X90]
C35  120pF  [CAPC1608X90]
C36  0.1uF  [CAPC1608X90]
C37  120pF  [CAPC1608X90]
C38  0.1uF  [CAPC1608X90]
C39  4.7uF  [CAPC1608X90]
C40  18pF  [CAPC1608X90]
C41  10uF  [CAPC1608X90]
C42  0.1uF  [CAPC1608X90]
C43  1.2pF  [CAPC1608X90]
C44  1.3pF  [CAPC1608X90]
C45  1.3pF  [CAPC1608X90]
C46  1uF  [CAPC1608X90]
C47  0.01uF  [CAPC1608X90]
C48  1uF  [CAPC1608X90]
C49  0.1uF  [CAPC1608X90]
H4  Mini SWD  [FTSH-105-01-XXX-DV-K]
J2  S3B-XH-A  [JST_S3B-XH-A]
L6  1 kOhms @ 100 MHz  [INDC1608X95N]
L7  1 kOhms @ 100 MHz  [INDC1608X95N]
L8  2.2uH  [INDC1608X95N]
L9  2.6nH  [INDC1608X95N]
LED1  GRN 0603  [LED_0603_GRN_WL-SMCW]
R27  1K  [RES_0603]
TP15  +3V  [TP]
TP16  HE_sensor_o/p  [TP]
TP17  HF_XTAL_I/P  [TP]
TP18  HF_XTAL_O/P  [TP]
TP19  LF_XTAL_I/P  [TP]
TP20  LF_XTAL_O/P  [TP]
U7  TMAG5231A2DQDBZR  [SOT95P237X112-3N]
Y3  OSC_38.4MHz  [OSC_38.4MHz]
Y4  OSC_32.768KHz  [OSC_32.768KHz]

### Blocks framed on the sheet
Power Conditioning: BT1 J2 TP15
Programming: H4
RF & decoupling: C34-C37 L6 L7
Hall effect sensor ckt: C33 TP16 U7
2.4GHz Antenna: A2 C40 C43-C45 L9
Clocks: TP17-TP20 Y3 Y4
Power & decoupling: C38 C39 C41 C42 C46-C49 L8
LED ckt: LED1 R27

### Ports
AVDD (out, see Client_Node_2[3B]), DVDD (out, see Client_Node_2[4A]), HALL_SENSOR_OP (in, see Client_Node_1[4A], Client_Node_2[2D]), HALL_SENSOR_OP (out, see Client_Node_1[1B], Client_Node_2[2D]), HFXTAL_I (in, see Client_Node_2[1A]), HFXTAL_O (out, see Client_Node_2[1A]), IOVDD (out, see Client_Node_2[3B]), LED (in, see Client_Node_2[2D]), LFXTAL_I (in, see Client_Node_2[2D]), LFXTAL_O (out, see Client_Node_2[2D]), PA_VDD (out), PTI_DATA_MG (bidir, see Client_Node_2[2D]), PTI_FRAME_MG (bidir, see Client_Node_2[2D]), RF2G4_IO (in, see Client_Node_2[2A]), RF_VDD (out), RST_MG (out, see Client_Node_2[3A]), SWCLK_MG (out, see Client_Node_2[2C]), SWDIO_MG (bidir, see Client_Node_2[2C]), SWO_MG (out, see Client_Node_2[2C]), VCOM_RX_MG (out, see Client_Node_2[2C]), VCOM_TX_MG (in, see Client_Node_2[2C]), VREGSW (out, see Client_Node_2[4A]), VREGVDD (out, see Client_Node_2[3A])

### Nets
+3V: BT1.P1(POS) BT1.P2(POS) C33.2 C38.1 C41.1 C42.1 C46.1 C47.1 C48.1 C49.1 H4.1 J2.1 L6.1 L7.1 L8.1 TP15.TP U7.1(VCC) ; port DVDD, port VREGVDD, port AVDD, port IOVDD
GND: A2.GND BT1.N(NEG) C33.1 C34.2 C35.2 C36.2 C37.2 C38.2 C39.2 C41.2 C42.2 C43.2 C44.2 C45.2 C46.2 C47.2 C48.2 C49.2 H4.2 J2.2 R27.1 U7.3(GND) Y3.2 Y3.4
NetA2_FEED: A2.FEED C40.2 C45.1
NetC34_1: C34.1 C35.1 L6.2 ; port RF_VDD
NetC36_1: C36.1 C37.1 L7.2 ; port PA_VDD
NetC39_1: C39.1 L8.2 ; port VREGSW
NetC40_1: C40.1 C44.1 L9.2
NetC43_1: C43.1 L9.1 ; port RF2G4_IO
NetH4_3: H4.3 ; port RST_MG
NetH4_4: H4.4 ; port VCOM_RX_MG
NetH4_5: H4.5 ; port VCOM_TX_MG
NetH4_6: H4.6 ; port SWO_MG
NetH4_7: H4.7 ; port PTI_FRAME_MG
NetH4_8: H4.8 ; port SWCLK_MG
NetH4_9: H4.9 ; port SWDIO_MG
NetH4_10: H4.10 ; port PTI_DATA_MG
NetJ2_3: J2.3 TP16.TP U7.2(OUT) ; port HALL_SENSOR_OP
NetLED1_A: LED1.A ; port LED
NetLED1_C: LED1.C R27.2
NetTP17_TP: TP17.TP Y3.1 ; port HFXTAL_I
NetTP18_TP: TP18.TP Y3.3 ; port HFXTAL_O
NetTP19_TP: TP19.TP Y4.1 ; port LFXTAL_I
NetTP20_TP: TP20.TP Y4.2 ; port LFXTAL_O

### Notes on the sheet
- (near TP18) High frequency clock
- Low frequency clock
- THIS DOCUMENT AND THE DATA DISCLOSED HEREIN OR
- HEREWITH IS THE PROPERTY OF ALTIUM LIMITED AND MAY
- DWG NO:
- REVISION
- REV:
- DESCRIPTION
- DATE
- APPROVED
- BE FREELY DISTRIBUTED IN WHOLE. NO RIGHTS ARE
- RESERVED OR EXPRESS OR IMPLIED WARANTEE GIVEN.
- ENG:
- APPROVALS
- PROJECT
- DSN:
- CHK:
- REFERENCE DOCUMENTS
- PROJECT REVISION:
- TITLE
- DOCUMENT REVISION:
- DESIGN ITEM:
- BOM:
- FAB DWG:
- PCB DWG:
- ASSY DWG:
- SCALE:
- A3
- SIZE
- CAGE CODE
- FILE NAME
- DWG NO.
- SHEET
- OF
- REV
- (in symbol LED_green) G

### Library data of the parts
A2 = FANT_2P4: Inverted F antenna
BT1 = BAT_3034: SMT Holder for 20mm Cell-Tin Nickel Plate; MP: 3034; MF: Keystone Electronics Corp.; SnapEDA_Link: https://www.snapeda.com/parts/3034/Keystone+Electronics/view-part/?ref=snap; Price: None; Check_prices: https://www.snapeda.com/parts/3034/Keystone+Electronics/view-part/?ref=eda; Availability: Not in stock; Value: *; Package: None; Supplier 1: Digikey; Supplier Part Number 1: 36-3034-ND
C33-C49 = CC0603KRX7R9BB104: as C11 on sheet Principal_Node; SnapEDA_Link: https://www.snapeda.com/parts/CC0603KRX7R9BB104/Yageo/view-part/?ref=snap; Package: 0603 Yageo; Value: *; MP: CC0603KRX7R9BB104; Check_prices: https://www.snapeda.com/parts/CC0603KRX7R9BB104/Yageo/view-part/?ref=eda; Supplier 1: Digikey
  C33 C38 C42 C46 C48 C49: Supplier Part Number 1: 445-12472-1-ND
  C34 C36: Supplier Part Number 1: 445-7456-1-ND
  C35 C37: Supplier Part Number 1: 399-C0603C121J5GACTUCT-ND
  C39: Supplier Part Number 1: 399-C0603C475K9PAC7867CT-ND
  C40: Supplier Part Number 1: 490-14486-1-ND
  C41: Supplier Part Number 1: 490-7202-1-ND
  C43: Supplier Part Number 1: 490-GRM0335C1H1R2WA01DCT-ND
  C44 C45: Supplier Part Number 1: 490-6120-1-ND
  C47: Supplier Part Number 1: 311-4054-1-ND
H4 = Debug Connector Mini SWD - 0.05": as H3 on sheet Principal_Node; RoHS: No; Category: Connectors; Stock 1: 201; Pricing 1: 1=1.95000 (USD); ComponentLink1URL: https://media.digikey.com/pdf/Data%20Sheets/Adafruit%20PDFs/4048_Web.pdf?src-supplier=Digi-Key; ComponentLink1Description: https://media.digikey.com/pdf/Data%20Sheets/Adafruit%20PDFs/4048_Web.pdf?src-supplier=Digi-Key; Supplier 1: Digikey; Supplier Part Number 1: 1528-2827-ND
J2 = S3B-XH-A: Connector Header Through Hole 3 position 0.098 (2.50mm); MF: JST Sales; MP: B3B-XH-A(LF)(SN); SnapEDA_Link: https://www.snapeda.com/parts/B3B-XH-A(LF)(SN)/JST+Sales+America+Inc./view-part/?ref=snap; Package: None; Value: *; Check_prices: https://www.snapeda.com/parts/B3B-XH-A(LF)(SN)/JST+Sales+America+Inc./view-part/?ref=eda; Supplier 1: Digikey; Supplier Part Number 1: 455-S3B-XH-A-ND
L6-L9 = LQM18DN100M70L: as L3 on sheet Principal_Node; MP: LQM18DN100M70L; Price: None; SnapEDA_Link: https://www.snapeda.com/parts/LQM18DN100M70L/Murata/view-part/4834755/?ref=snap; Package: 0603 Murata; Availability: Unavailable; Value: *
  L6: Supplier 1: Digikey; Supplier Part Number 1: 490-1015-1-ND
  L8: Supplier 1: Digikey; Supplier Part Number 1: 732-14076-1-ND
  L9: Supplier 1: Digikey; Supplier Part Number 1: 490-13907-1-ND
LED1 = LED_green: LED, 0603, GREEN, 430MCD, 520NM; Manufacturer: Wurth Electronics; Manufacturer Part Number: 150060GS75000; Dynamic Catalog: 0603 Rectangle with Flat Top Chip LEDs; 3D Model: SMCW_0603.igs / SMCW_0603.stp / SMCW_0603.wrl; Wavelength - Peak: 515nm; Voltage - Forward (Vf) (Typ): 3.2V; Current - Test: 20mA; Viewing Angle: 140°; Lens Type: Clear; Lens Style/Size: Rectangle with Flat Top, 1.1mm x 0.7mm; Other Names: 732-4971-2; Supplier 1: Digi-Key; Stock 1: 34964; Pricing 1: 1=0.14, 50=0.129, 100=0.11, 500=0.095 (USD); Standard Package: 4,000; Category: Optoelectronics; Family: LED Indication - Discrete; Series: WL-SMCW; Packaging: Tape & Reel (TR); Color: Green; Wavelength - Dominant: 520nm; Millicandela Rating: 430mcd; Package / Case: 0603 (1608 Metric); Size / Dimension: 1.60mm L x 0.80mm W; Height: 0.70mm; Mounting Type: Surface Mount; Online Catalog: 0603 Rectangle with Flat Top Chip LEDs; ComponentLink1URL: https://katalog.we-online.de/led/datasheet/150060GS75000.pdf?src-supplier=Digi-Key; ComponentLink1Description: https://katalog.we-online.de/led/datasheet/150060GS75000.pdf?src-supplier=Digi-Key; ComponentLink2URL: http://www.produktinfo.conrad.com/datenblaetter/750000-774999/759427-da-01-en-CHIPLED_0603_W_KL_GRUEN_150060GS75000.pdf?src-supplier=Conrad; ComponentLink2Description: http://www.produktinfo.conrad.com/datenblaetter/750000-774999/759427-da-01-en-CHIPLED_0603_W_KL_GRUEN_150060GS75000.pdf?src-supplier=Conrad; Supplier Part Number 1: 732-4971-1-ND
R27 = RES_0603: Thick film general purpose resistor 0603; MP: RC0603JR-070RL; Availability: Unavailable; Package: None; Value: *; Price: None; Supplier 1: Digikey; Supplier Part Number 1: A106049CT-ND
TP15-TP20 = Test_point: as TP3 on sheet Power_Sheet; Value: *; Availability: In Stock; Purchase-URL: https://pricing.snapeda.com/search/part/5019/?ref=eda; Package: None; Price: None
U7 = TMAG5231A2DQDBZR: SOT-23-3-Digital Switch Omnipolar Switch Push-Pull Hall Effect; MF: {'manufacturer': u'Texas Instruments'}; Package: None; Price: None; Value: *; MP: TMAG5231A2DQDBZR; Availability: Unavailable; Supplier 1: Digikey; Supplier Part Number 1: 296-TMAG5231A2DQDBZRCT-ND
Y3 = OSC_38.4MHz: as Y1 on sheet Principal_Node; Package: None; Price: None; Value: *; Availability: Unavailable; Supplier 1: Digikey; Supplier Part Number 1: 4606-TZ3398BCT-ND
Y4 = OSC_32.768KHz: as Y2 on sheet Principal_Node; Package: SMD-2 Micro Crystal; Price: None; Value: *; SnapEDA_Link: https://www.snapeda.com/parts/CM8V-T1A-32.768KHZ-7PF-20PPM-TA-QC/Micro+Crystal/view-part/?ref=snap; Availability: Not in stock; Check_prices: https://www.snapeda.com/parts/CM8V-T1A-32.768KHZ-7PF-20PPM-TA-QC/Micro+Crystal/view-part/?ref=eda; Supplier 1: Digikey; Supplier Part Number 1: 2195-CM8V-T1A-32.768KHZ-7PF-20PPM-TA-QCCT-ND

## Sheet Client_Node_2.SchDoc: Client_Node_2
size A4; DrawnBy: Project_Vega_Team; Revision: 1; SheetNumber: 8; SheetTotal: 8
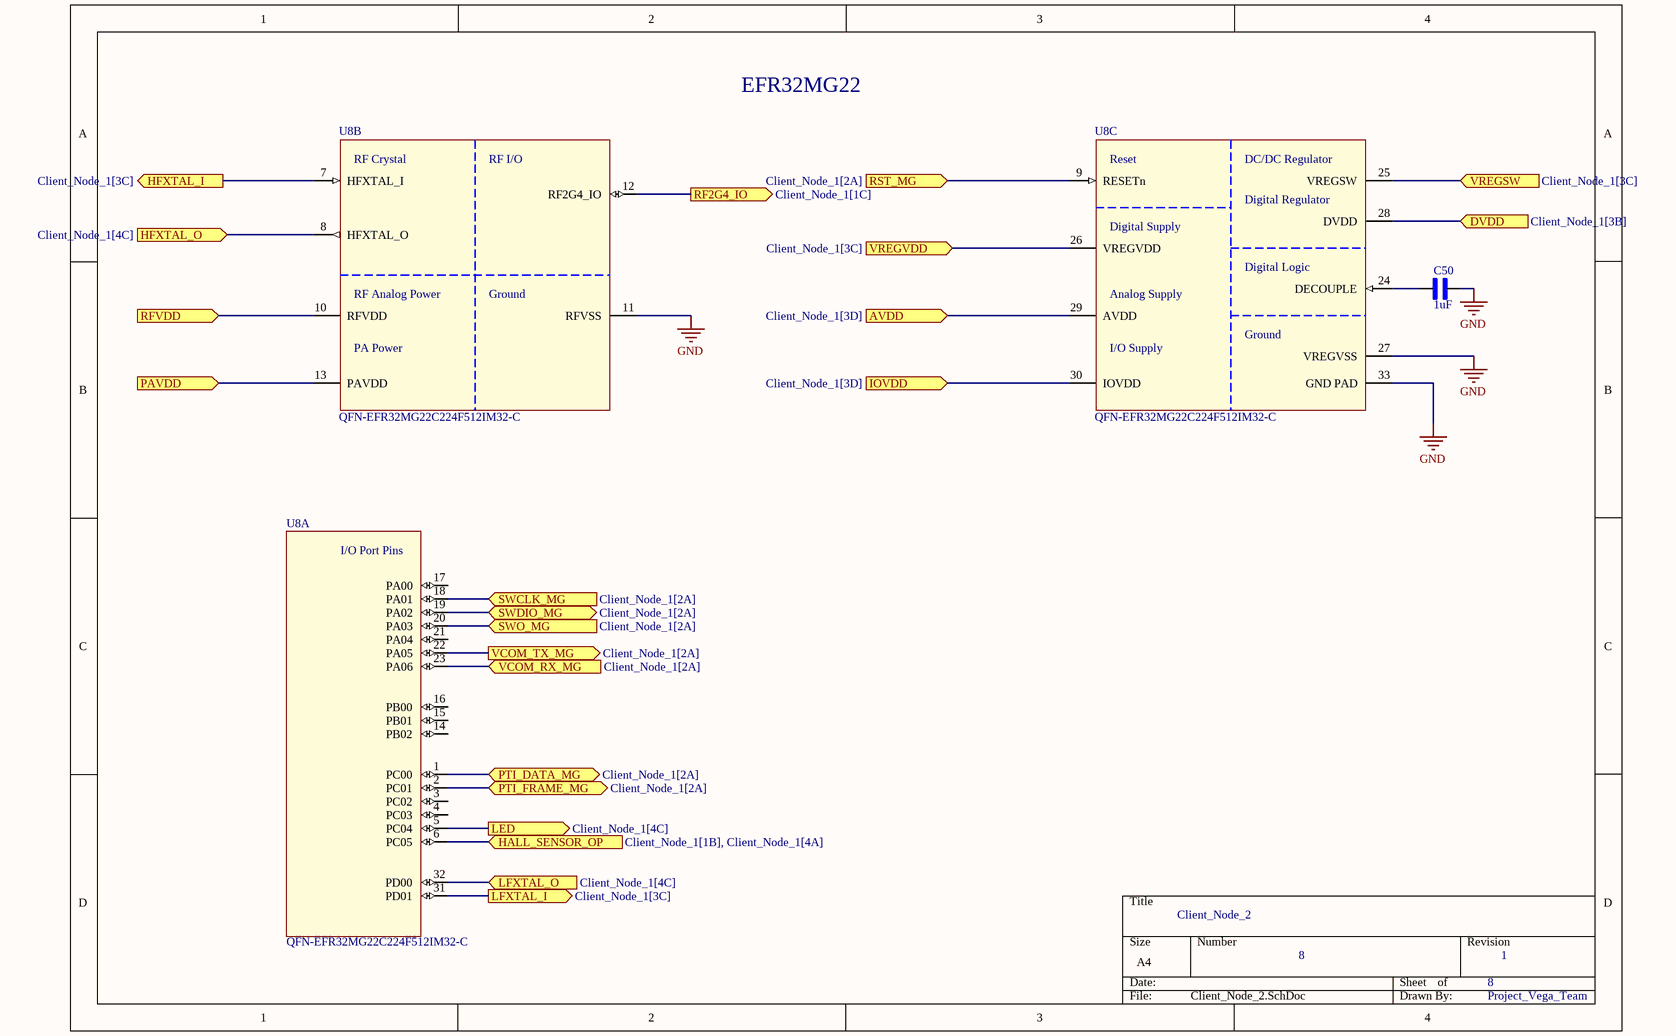
[diagram p4: Client_Node_2.SchDoc]

### Parts
C50  1uF  [CAPC1608X90]
U8  QFN-EFR32MG22C224F512IM32-C  [QFN32-EFR32xG2xIM32-BR]  (parts A,B,C of 3)

### Ports
AVDD (in, see Client_Node_1[3D]), DVDD (in, see Client_Node_1[3B]), HALL_SENSOR_OP (in, see Client_Node_1[1B], Client_Node_1[4A]), HFXTAL_I (out, see Client_Node_1[3C]), HFXTAL_O (in, see Client_Node_1[4C]), IOVDD (in, see Client_Node_1[3D]), LED (out, see Client_Node_1[4C]), LFXTAL_I (out, see Client_Node_1[3C]), LFXTAL_O (in, see Client_Node_1[4C]), PAVDD (in), PTI_DATA_MG (bidir, see Client_Node_1[2A]), PTI_FRAME_MG (bidir, see Client_Node_1[2A]), RF2G4_IO (out, see Client_Node_1[1C]), RFVDD (in), RST_MG (in, see Client_Node_1[2A]), SWCLK_MG (in, see Client_Node_1[2A]), SWDIO_MG (bidir, see Client_Node_1[2A]), SWO_MG (in, see Client_Node_1[2A]), VCOM_RX_MG (in, see Client_Node_1[2A]), VCOM_TX_MG (out, see Client_Node_1[2A]), VREGSW (in, see Client_Node_1[3C]), VREGVDD (in, see Client_Node_1[3C])

### Nets
+3V: U8.26(VREGVDD) U8.28(DVDD) U8.29(AVDD) U8.30(IOVDD) ; port DVDD, port VREGVDD, port AVDD, port IOVDD
GND: C50.2 U8.11(RFVSS) U8.27(VREGVSS) U8.33(GND_PAD)
NetC39_1: U8.25(VREGSW) ; port VREGSW
NetC43_1: U8.12(RF2G4_IO) ; port RF2G4_IO
NetC50_1: C50.1 U8.24(DECOUPLE)
NetH4_3: U8.9(RESETn) ; port RST_MG
NetH4_4: U8.23(PA06) ; port VCOM_RX_MG
NetH4_5: U8.22(PA05) ; port VCOM_TX_MG
NetH4_6: U8.20(PA03) ; port SWO_MG
NetH4_7: U8.2(PC01) ; port PTI_FRAME_MG
NetH4_8: U8.18(PA01) ; port SWCLK_MG
NetH4_9: U8.19(PA02) ; port SWDIO_MG
NetH4_10: U8.1(PC00) ; port PTI_DATA_MG
NetJ2_3: U8.6(PC05) ; port HALL_SENSOR_OP
NetLED1_A: U8.5(PC04) ; port LED
NetTP17_TP: U8.7(HFXTAL_I) ; port HFXTAL_I
NetTP18_TP: U8.8(HFXTAL_O) ; port HFXTAL_O
NetTP19_TP: U8.31(PD01) ; port LFXTAL_I
NetTP20_TP: U8.32(PD00) ; port LFXTAL_O
NetU8_10: U8.10(RFVDD) ; port RFVDD
NetU8_13: U8.13(PAVDD) ; port PAVDD

Not connected (* = marked no-connect by the designer): U8 3(PC02) 4(PC03) 14(PB02) 15(PB01) 16(PB00) 17(PA00) 21(PA04)

### Notes on the sheet
- EFR32MG22
- (in symbol EFR32MG22C224F512IM32-C, part A) I/O Port Pins
- (in symbol EFR32MG22C224F512IM32-C, part B) RF Crystal; RF I/O; RF Analog Power; Ground; PA Power
- (in symbol EFR32MG22C224F512IM32-C, part C) Reset; DC/DC Regulator; Digital Regulator; Digital Supply; Digital Logic; Analog Supply; Ground; I/O Supply

### Library data of the parts
C50 = CC0603KRX7R9BB104: as C11 on sheet Principal_Node; SnapEDA_Link: https://www.snapeda.com/parts/CC0603KRX7R9BB104/Yageo/view-part/?ref=snap; Package: 0603 Yageo; Value: *; MP: CC0603KRX7R9BB104; Check_prices: https://www.snapeda.com/parts/CC0603KRX7R9BB104/Yageo/view-part/?ref=eda; Supplier 1: Digikey; Supplier Part Number 1: 445-12472-1-ND
U8 = EFR32MG22C224F512IM32-C: IC RF TxRx + MCU WiFi Bluetooth v5.2, Zigbee® 2.4GHz 32-VFQFN Exposed Pad

## Nets that join several sheets
+3V: Client_Node_1 (17 pins), Client_Node_2 (U8.26 U8.28 U8.29 U8.30)
GND: Power_Sheet (18 pins), Principal_Node (19 pins), Project_Node_Sensors (16 pins), Client_Node_1 (24 pins), Client_Node_2 (C50.2 U8.11 U8.27 U8.33)
RST_BG: Principal_Node (15 pins), Project_Node_Sensors (R23.2 R24.2 R25.2)
I2C0_SCK: Principal_Node (U3.17), Project_Node_Sensors (5 pins)
I2C0_SDA: Principal_Node (U3.21), Project_Node_Sensors (5 pins)
NetC30_2: Principal_Node (R15.2), Project_Node_Sensors (C30.2 P1.5 R22.1 TP12.TP)
NetC39_1: Client_Node_1 (C39.1 L8.2), Client_Node_2 (U8.25)
NetC43_1: Client_Node_1 (C43.1 L9.1), Client_Node_2 (U8.12)
NetH4_3: Client_Node_1 (H4.3), Client_Node_2 (U8.9)
NetH4_4: Client_Node_1 (H4.4), Client_Node_2 (U8.23)
NetH4_5: Client_Node_1 (H4.5), Client_Node_2 (U8.22)
NetH4_6: Client_Node_1 (H4.6), Client_Node_2 (U8.20)
NetH4_7: Client_Node_1 (H4.7), Client_Node_2 (U8.2)
NetH4_8: Client_Node_1 (H4.8), Client_Node_2 (U8.18)
NetH4_9: Client_Node_1 (H4.9), Client_Node_2 (U8.19)
NetH4_10: Client_Node_1 (H4.10), Client_Node_2 (U8.1)
NetJ2_3: Client_Node_1 (J2.3 TP16.TP U7.2), Client_Node_2 (U8.6)
NetLED1_A: Client_Node_1 (LED1.A), Client_Node_2 (U8.5)
NetP1_1: Principal_Node (U3.30), Project_Node_Sensors (P1.1 TP8.TP)
NetP1_2: Principal_Node (U3.29), Project_Node_Sensors (P1.2 TP9.TP)
NetP1_3: Principal_Node (U3.28), Project_Node_Sensors (P1.3 TP10.TP)
NetP1_4: Principal_Node (U3.16), Project_Node_Sensors (P1.4 TP11.TP)
NetTP4_TP: Principal_Node (U3.2), Project_Node_Sensors (TP4.TP U4.12)
NetTP5_TP: Principal_Node (U3.1), Project_Node_Sensors (TP5.TP U4.13)
NetTP6_TP: Principal_Node (U3.4), Project_Node_Sensors (TP6.TP U4.14)
NetTP7_TP: Principal_Node (U3.3), Project_Node_Sensors (TP7.TP U4.1)
NetTP17_TP: Client_Node_1 (TP17.TP Y3.1), Client_Node_2 (U8.7)
NetTP18_TP: Client_Node_1 (TP18.TP Y3.3), Client_Node_2 (U8.8)
NetTP19_TP: Client_Node_1 (TP19.TP Y4.1), Client_Node_2 (U8.31)
NetTP20_TP: Client_Node_1 (TP20.TP Y4.2), Client_Node_2 (U8.32)